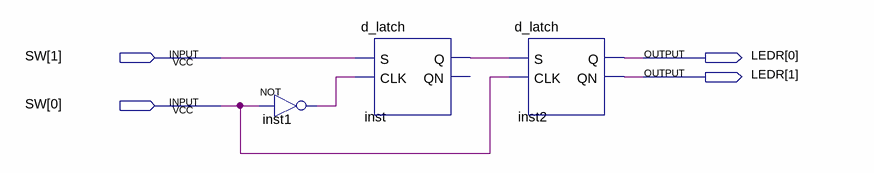
[diagram p0: schematic sheet]
// Quartus schematic part_c.bdf as structural Verilog: 3 symbols, 4 pins
module part_c (
  input  [1:0] SW,
  output [1:0] LEDR
);

  wire inst1_out, inst_q;

  not inst1 (inst1_out, SW[0]);
  d_latch inst (.S(SW[1]), .CLK(inst1_out), .Q(inst_q));  // open: QN
  d_latch inst2 (.S(inst_q), .CLK(SW[0]), .Q(LEDR[0]), .QN(LEDR[1]));
endmodule
